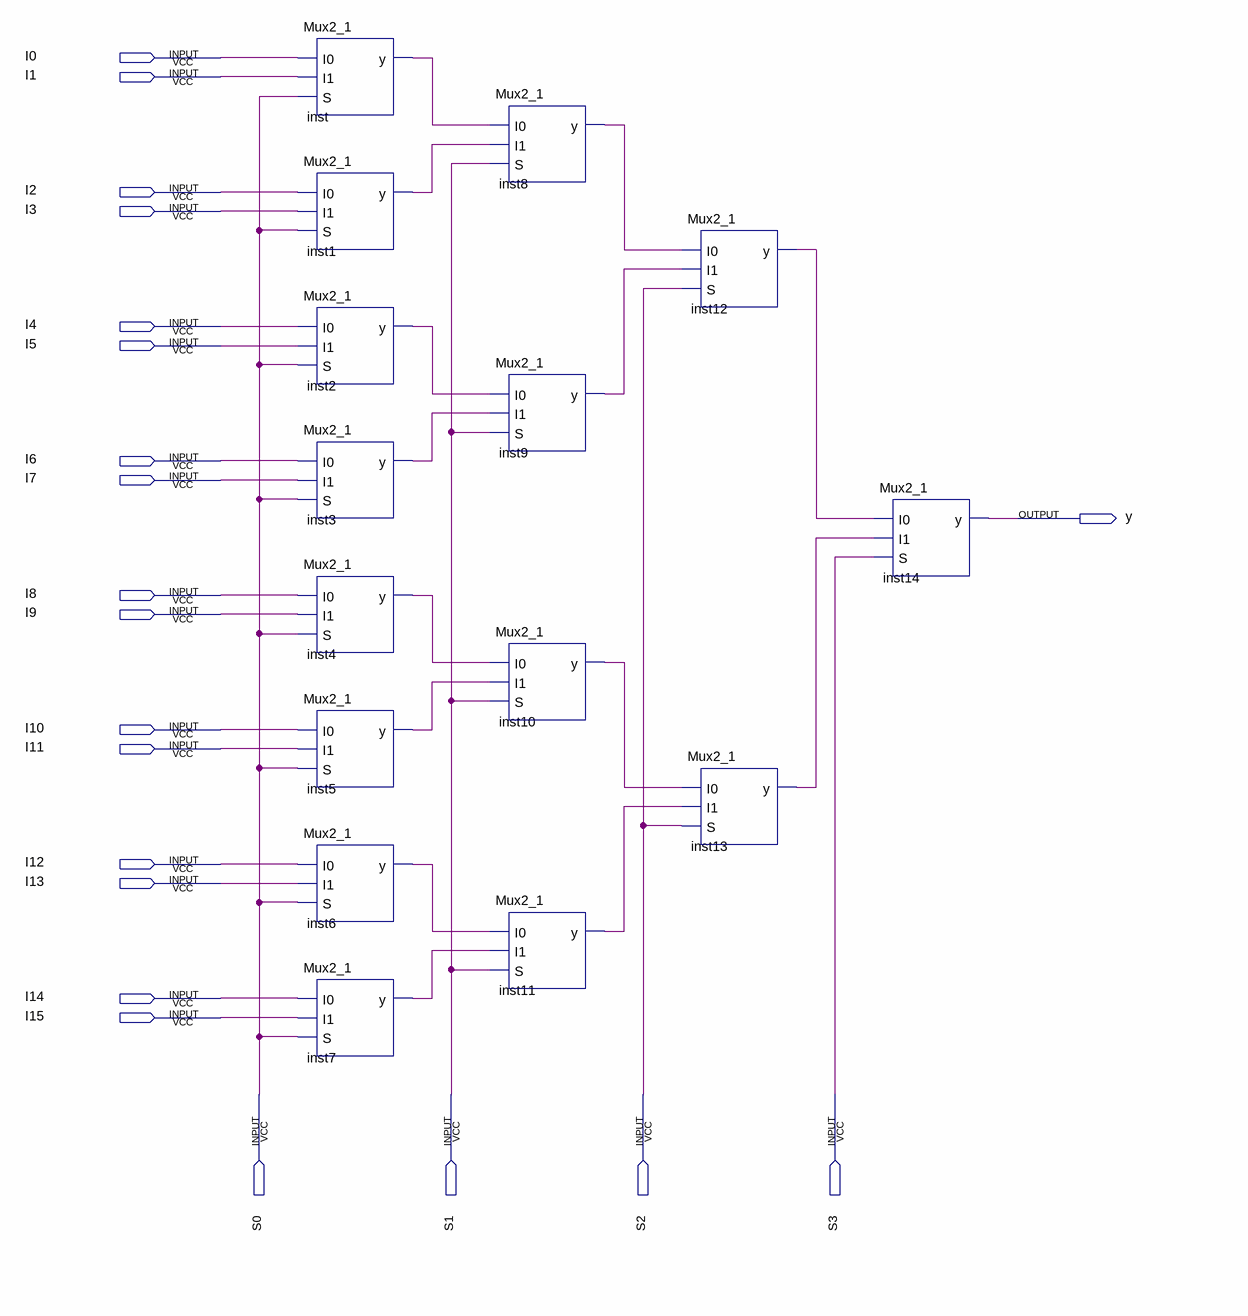
[diagram p0: schematic sheet]
// Quartus schematic Mux16_1.bdf as structural Verilog: 15 symbols, 21 pins
module Mux16_1 (
  input  I0,
  input  I1,
  input  I2,
  input  I3,
  input  I4,
  input  I5,
  input  I6,
  input  I7,
  input  I8,
  input  I9,
  input  I10,
  input  I11,
  input  I12,
  input  I13,
  input  I14,
  input  I15,
  input  S0,
  input  S1,
  input  S2,
  input  S3,
  output y
);

  wire inst1_y, inst2_y, inst3_y, inst4_y, inst5_y, inst6_y, inst7_y, inst8_y, inst9_y, inst10_y, inst11_y,
       inst12_y, inst13_y, inst_y;

  Mux2_1 inst (.I0(I0), .I1(I1), .S(S0), .y(inst_y));
  Mux2_1 inst1 (.I0(I2), .I1(I3), .S(S0), .y(inst1_y));
  Mux2_1 inst2 (.I0(I4), .I1(I5), .S(S0), .y(inst2_y));
  Mux2_1 inst3 (.I0(I6), .I1(I7), .S(S0), .y(inst3_y));
  Mux2_1 inst4 (.I0(I8), .I1(I9), .S(S0), .y(inst4_y));
  Mux2_1 inst5 (.I0(I10), .I1(I11), .S(S0), .y(inst5_y));
  Mux2_1 inst6 (.I0(I12), .I1(I13), .S(S0), .y(inst6_y));
  Mux2_1 inst7 (.I0(I14), .I1(I15), .S(S0), .y(inst7_y));
  Mux2_1 inst8 (.I0(inst_y), .I1(inst1_y), .S(S1), .y(inst8_y));
  Mux2_1 inst9 (.I0(inst2_y), .I1(inst3_y), .S(S1), .y(inst9_y));
  Mux2_1 inst10 (.I0(inst4_y), .I1(inst5_y), .S(S1), .y(inst10_y));
  Mux2_1 inst11 (.I0(inst6_y), .I1(inst7_y), .S(S1), .y(inst11_y));
  Mux2_1 inst12 (.I0(inst8_y), .I1(inst9_y), .S(S2), .y(inst12_y));
  Mux2_1 inst13 (.I0(inst10_y), .I1(inst11_y), .S(S2), .y(inst13_y));
  Mux2_1 inst14 (.I0(inst12_y), .I1(inst13_y), .S(S3), .y(y));
endmodule
